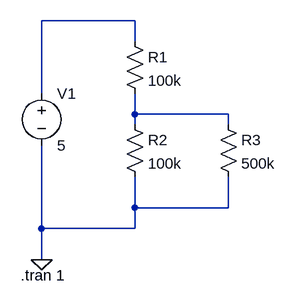
[diagram p0: schematic T4_2_VD.asc]
T4_2_VD.asc, the LTspice schematic file:
Version 4
SHEET 1 880 680
WIRE 240 16 96 16
WIRE 240 48 240 16
WIRE 96 128 96 16
WIRE 240 160 240 128
WIRE 384 160 240 160
WIRE 240 176 240 160
WIRE 384 176 384 160
WIRE 240 304 240 256
WIRE 384 304 384 256
WIRE 384 304 240 304
WIRE 96 336 96 208
WIRE 240 336 240 304
WIRE 240 336 96 336
WIRE 96 384 96 336
FLAG 96 384 0
SYMBOL voltage 96 112 R0
WINDOW 123 0 0 Left 0
WINDOW 39 0 0 Left 0
SYMATTR InstName V1
SYMATTR Value 5
SYMBOL res 224 32 R0
SYMATTR InstName R1
SYMATTR Value 100k
SYMBOL res 224 160 R0
SYMATTR InstName R2
SYMATTR Value 100k
SYMBOL res 368 160 R0
SYMATTR InstName R3
SYMATTR Value 500k
TEXT 64 408 Left 2 !.tran 1

The netlist it stands for:
* T4_2_VD.asc
V1 N001 0 5
R1 N001 N002 100k
R2 N002 0 100k
R3 N002 0 500k
.tran 1
.backanno
.end